# Altium schematic sheet Keyboard-Left.SchDoc: Insane Keyboard
size Letter; Author: Parth Thakkar; CompanyName: Insane; DrawnBy: Parth; Engineer: Parth; Organization: Low Self Esteam; DocumentNumber: 1; Revision: v1.0; SheetNumber: 1; SheetTotal: 8
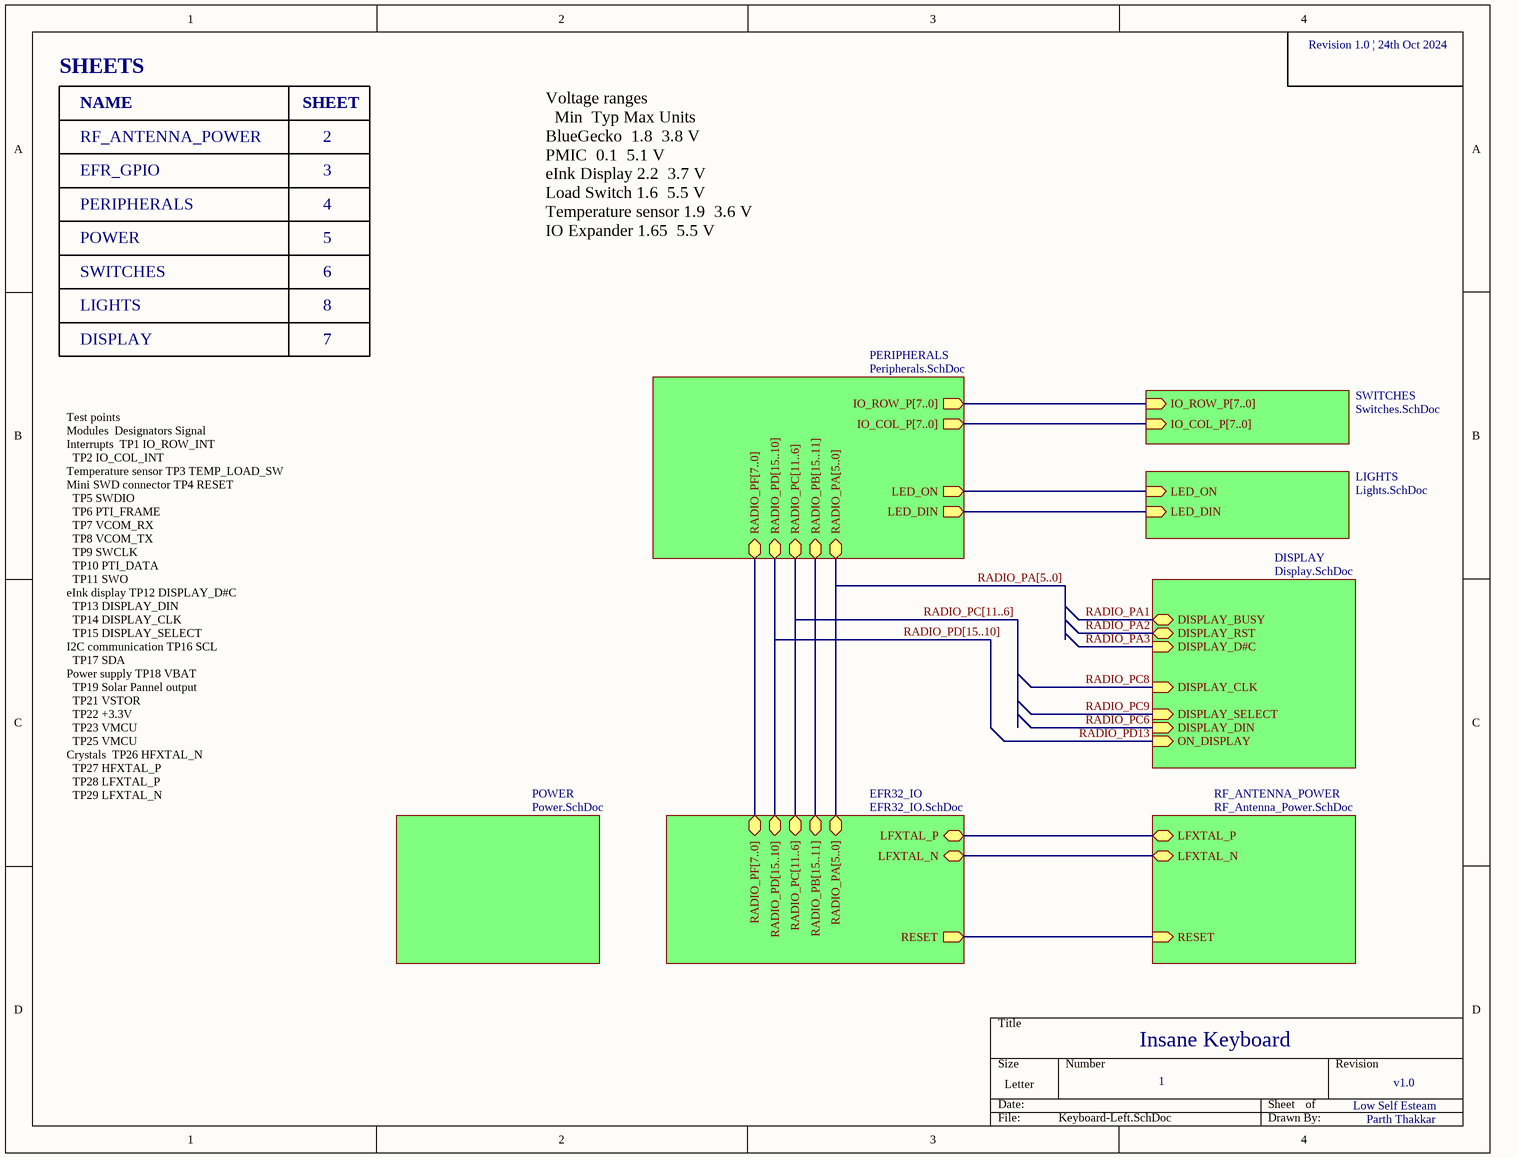
[diagram p0: Keyboard-Left.SchDoc]

## Sub-sheets
DISPLAY = Display.SchDoc: DISPLAY_DIN (in), DISPLAY_CLK (in), DISPLAY_D#C (in), DISPLAY_SELECT (in), DISPLAY_RST (bidir), DISPLAY_BUSY (bidir), ON_DISPLAY (in)
EFR32_IO = EFR32_IO.SchDoc: RADIO_PA[5..0] (bidir), RADIO_PD[15..10] (bidir), RADIO_PF[7..0] (bidir), RADIO_PB[15..11] (bidir), RADIO_PC[11..6] (bidir), RESET (out), LFXTAL_N (bidir), LFXTAL_P (bidir)
LIGHTS = Lights.SchDoc: LED_DIN (in), LED_ON (in)
PERIPHERALS = Peripherals.SchDoc: IO_ROW_P[7..0] (out), IO_COL_P[7..0] (out), RADIO_PA[5..0] (bidir), RADIO_PC[11..6] (bidir), RADIO_PD[15..10] (bidir), RADIO_PB[15..11] (bidir), RADIO_PF[7..0] (bidir), LED_DIN (out), LED_ON (out)
POWER = Power.SchDoc: no entries
RF_ANTENNA_POWER = RF_Antenna_Power.SchDoc: RESET (in), LFXTAL_N (bidir), LFXTAL_P (bidir)
SWITCHES = Switches.SchDoc: IO_ROW_P[7..0] (in), IO_COL_P[7..0] (in)

## Nets
RADIO_PA1: sheet DISPLAY/DISPLAY_BUSY
RADIO_PA2: sheet DISPLAY/DISPLAY_RST
RADIO_PA3: sheet DISPLAY/DISPLAY_D#C
RADIO_PC6: sheet DISPLAY/DISPLAY_DIN
RADIO_PC8: sheet DISPLAY/DISPLAY_CLK
RADIO_PC9: sheet DISPLAY/DISPLAY_SELECT
RADIO_PD13: sheet DISPLAY/ON_DISPLAY
(unnamed): sheet RF_ANTENNA_POWER/RESET, sheet EFR32_IO/RESET
(unnamed): sheet RF_ANTENNA_POWER/LFXTAL_N, sheet EFR32_IO/LFXTAL_N
(unnamed): sheet RF_ANTENNA_POWER/LFXTAL_P, sheet EFR32_IO/LFXTAL_P
(unnamed): sheet PERIPHERALS/LED_DIN, sheet LIGHTS/LED_DIN
(unnamed): sheet PERIPHERALS/LED_ON, sheet LIGHTS/LED_ON

## Buses and harness runs
bus RADIO_PA[5..0] = sheet EFR32_IO/RADIO_PA[5..0] = sheet PERIPHERALS/RADIO_PA[5..0]
bus RADIO_PC[11..6] = sheet EFR32_IO/RADIO_PC[11..6] = sheet PERIPHERALS/RADIO_PC[11..6]
bus RADIO_PD[15..10] = sheet EFR32_IO/RADIO_PD[15..10] = sheet PERIPHERALS/RADIO_PD[15..10]
bus sheet EFR32_IO/RADIO_PB[15..11] = sheet PERIPHERALS/RADIO_PB[15..11]
bus sheet EFR32_IO/RADIO_PF[7..0] = sheet PERIPHERALS/RADIO_PF[7..0]
bus sheet PERIPHERALS/IO_COL_P[7..0] = sheet SWITCHES/IO_COL_P[7..0]
bus sheet PERIPHERALS/IO_ROW_P[7..0] = sheet SWITCHES/IO_ROW_P[7..0]

## Notes on the sheet
- SHEETS
- Revision 1.0 | 24th Oct 2024
- NAME
- RF_ANTENNA_POWER
- SHEET
- 2
- PERIPHERALS
- EFR_GPIO
- 4
- 3
- POWER
- SWITCHES
- 5
- 6
- Voltage ranges
  Min 	Typ	Max	Units
  BlueGecko		1.8		3.8	V
  PMIC		0.1		5.1	V
  eInk Display	2.2		3.7	V
  Load Switch	1.6		5.5	V
  Temperature sensor	1.9		3.6	V
  IO Expander	1.65		5.5	V
- LIGHTS
- DISPLAY
- 8
- 7
- Test points
  Modules		Designators	Signal
  Interrupts		TP1	IO_ROW_INT
  TP2	IO_COL_INT
  Temperature sensor	TP3	TEMP_LOAD_SW
  Mini SWD connector	TP4	RESET
  TP5	SWDIO
  TP6	PTI_FRAME
  TP7	VCOM_RX
  TP8	VCOM_TX
  TP9	SWCLK
  TP10	PTI_DATA
  TP11	SWO
  eInk display	TP12	DISPLAY_D#C
  TP13	DISPLAY_DIN
  TP14	DISPLAY_CLK
  TP15	DISPLAY_SELECT
  I2C communication	TP16	SCL
  TP17	SDA
  Power supply	TP18	VBAT
  TP19	Solar Pannel output
  TP21	VSTOR
  TP22	+3.3V
  TP23	VMCU
  TP25	VMCU
  Crystals		TP26	HFXTAL_N
  TP27	HFXTAL_P
  TP28	LFXTAL_P
  TP29	LFXTAL_N